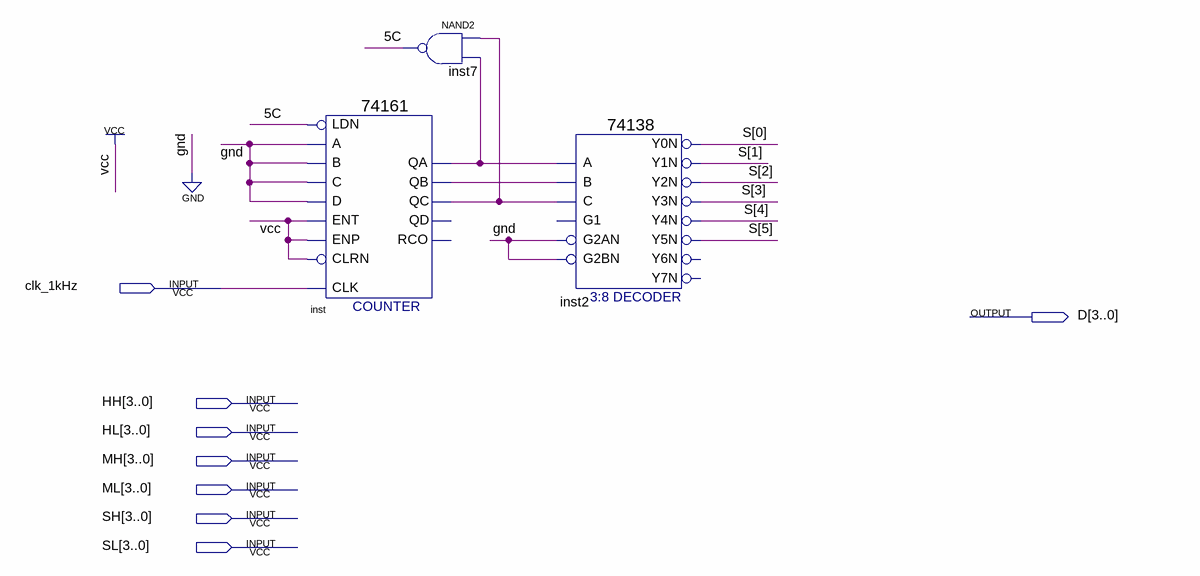
[diagram p0: schematic sheet]
// Quartus schematic switch_pro.bdf as structural Verilog: 3 symbols, 8 pins
module switch_pro (
  input  clk_1kHz,
  input  [3:0] HH,
  input  [3:0] HL,
  input  [3:0] MH,
  input  [3:0] ML,
  input  [3:0] SH,
  input  [3:0] SL,
  output [3:0] D
);

  wire \5C , inst_qa, inst_qb, inst_qc;
  wire [5:0] S;

  \74161  inst (
    .CLRN(1'b1), .CLK(clk_1kHz), .ENP(1'b1), .LDN(\5C ), .A(1'b0), .D(1'b0), .ENT(1'b1), .B(1'b0), .C(1'b0),
    .QC(inst_qc), .QB(inst_qb), .QA(inst_qa));  // open: QD, RCO
  nand inst7 (\5C , inst_qc, inst_qa);
  \74138  inst2 (
    .A(inst_qa), .B(inst_qb), .C(inst_qc), .G2AN(1'b0), .G2BN(1'b0), .Y0N(S[0]), .Y1N(S[1]), .Y2N(S[2]),
    .Y3N(S[3]), .Y4N(S[4]), .Y5N(S[5]));  // open: G1, Y6N, Y7N
endmodule
